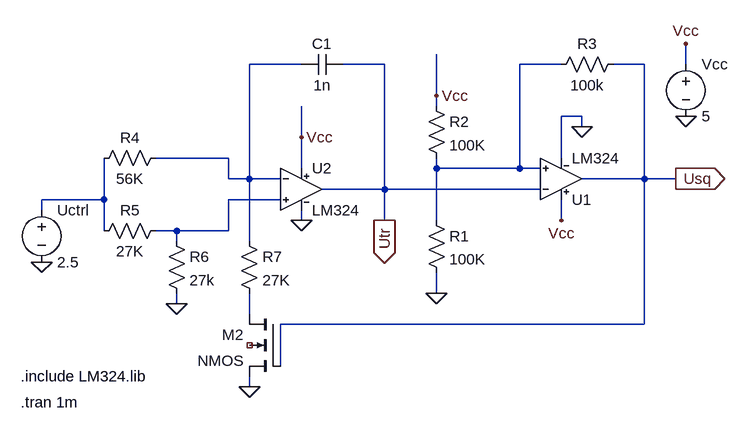
[diagram p0: schematic lab_3.asc]
lab_3.asc, the LTspice schematic file:
Version 4.1
SHEET 1 948 680
WIRE 96 16 16 16
WIRE 224 16 160 16
WIRE 496 16 432 16
WIRE 624 16 576 16
WIRE 688 16 688 -16
WIRE 304 64 304 0
WIRE 304 80 304 64
WIRE 528 96 496 96
WIRE 528 112 528 96
WIRE 96 128 96 80
WIRE -16 160 -128 160
WIRE 496 160 496 96
WIRE 96 176 96 128
WIRE 304 176 304 160
WIRE 432 176 432 16
WIRE 432 176 304 176
WIRE 464 176 432 176
WIRE -16 192 -16 160
WIRE 16 192 16 16
WIRE 16 192 -16 192
WIRE 64 192 16 192
WIRE 624 192 624 16
WIRE 624 192 528 192
WIRE 672 192 624 192
WIRE 224 208 224 16
WIRE 224 208 128 208
WIRE 464 208 224 208
WIRE -208 224 -208 160
WIRE -208 224 -304 224
WIRE 64 224 -16 224
WIRE -304 240 -304 224
WIRE 96 256 96 240
WIRE 224 256 224 208
WIRE 304 256 304 176
WIRE 496 256 496 224
WIRE -208 272 -208 224
WIRE -96 272 -128 272
WIRE -16 272 -16 224
WIRE -16 272 -96 272
WIRE -96 288 -96 272
WIRE 16 288 16 192
WIRE 304 368 304 336
WIRE -96 384 -96 368
WIRE 16 400 16 368
WIRE 624 416 624 192
WIRE 624 416 64 416
WIRE 64 480 64 416
WIRE 16 512 16 496
FLAG 96 256 0
FLAG -96 384 0
FLAG 16 512 0
FLAG 304 368 0
FLAG 528 112 0
FLAG 688 96 0
FLAG 224 256 Utr
IOPIN 224 256 Out
FLAG 672 192 Usq
IOPIN 672 192 Out
FLAG -304 320 0
FLAG 688 -16 Vcc
FLAG 496 256 Vcc
FLAG 96 128 Vcc
FLAG 304 64 Vcc
SYMBOL LM324 96 208 R0
SYMATTR InstName U2
SYMBOL LM324 496 192 M180
SYMATTR InstName U1
SYMBOL res -112 144 R90
WINDOW 0 0 56 VBottom 2
WINDOW 3 32 56 VTop 2
SYMATTR InstName R4
SYMATTR Value 56K
SYMATTR SpiceLine tol=1 pwr=0.1
SYMBOL res -112 256 R90
WINDOW 0 0 56 VBottom 2
WINDOW 3 32 56 VTop 2
SYMATTR InstName R5
SYMATTR Value 27K
SYMATTR SpiceLine tol=1 pwr=0.1
SYMBOL res -112 272 R0
SYMATTR InstName R6
SYMATTR Value 27k
SYMBOL res 0 272 R0
SYMATTR InstName R7
SYMATTR Value 27K
SYMBOL cap 160 0 R90
WINDOW 0 0 32 VBottom 2
WINDOW 3 32 32 VTop 2
SYMATTR InstName C1
SYMATTR Value 1n
SYMBOL res 288 64 R0
SYMATTR InstName R2
SYMATTR Value 100K
SYMATTR SpiceLine tol=1 pwr=0.1
SYMBOL res 288 240 R0
SYMATTR InstName R1
SYMATTR Value 100K
SYMATTR SpiceLine tol=1 pwr=0.1
SYMBOL res 592 0 R90
WINDOW 0 0 56 VBottom 2
WINDOW 3 32 56 VTop 2
SYMATTR InstName R3
SYMATTR Value 100k
SYMBOL voltage -304 224 R0
WINDOW 123 0 0 Left 0
WINDOW 39 0 0 Left 0
SYMATTR InstName Uctrl
SYMATTR Value 2.5
SYMBOL voltage 688 0 R0
WINDOW 123 0 0 Left 0
WINDOW 39 0 0 Left 0
SYMATTR InstName Vcc
SYMATTR Value 5
SYMBOL nmos4 64 400 M0
SYMATTR InstName M2
TEXT -336 536 Left 2 !.tran 1m
TEXT -336 496 Left 2 !.include LM324.lib

The netlist it stands for:
* lab_3.asc
X§U2 N004 N001 Vcc 0 Utr LM324  ; pins In+ In- V+ V- OUT
X§U1 N002 Utr Vcc 0 Usq LM324  ; pins In+ In- V+ V- OUT
R4 N001 N003 56K tol=1 pwr=0.1
R5 N004 N003 27K tol=1 pwr=0.1
R6 N004 0 27k
R7 N001 N005 27K
C1 Utr N001 1n
R2 Vcc N002 100K tol=1 pwr=0.1
R1 N002 0 100K tol=1 pwr=0.1
R3 Usq N002 100k
V§Uctrl N003 0 2.5
Vcc Vcc 0 5
M2 N005 Usq 0 NC_01 NMOS
.model NMOS NMOS
.model PMOS PMOS
.lib standard.mos
.tran 1m
.include LM324.lib
.backanno
.end